# EAGLE schematic lesson2 (EAGLE 8.2.0)
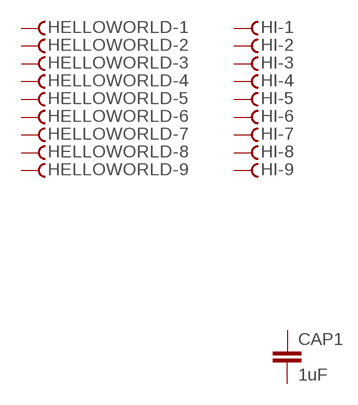
[diagram p0: schematic, sheet 1]

## Parts
CAP1  1uF  C-EU025-024X044  [C025-024X044]
HELLOWORLD  F09DS  [F09D]
HI  F09DS  [F09D]
Unconnected: CAP1.1 CAP1.2 HELLOWORLD.1 HELLOWORLD.2 HELLOWORLD.3 HELLOWORLD.4 HELLOWORLD.5 HELLOWORLD.6 HELLOWORLD.7 HELLOWORLD.8 HELLOWORLD.9 HI.1 HI.2 HI.3 HI.4 HI.5 HI.6 HI.7 HI.8 HI.9

## Library data of the parts
CAP1 = rcl:C-EU: CAPACITOR, European symbol
HELLOWORLD HI = con-subd:F09?S: SUB-D; OC_FARNELL: unknown; OC_NEWARK: unknown